# Altium project DDR4-UDIMM — 16 GB DDR4.PrjPcb (part 2 of 2)
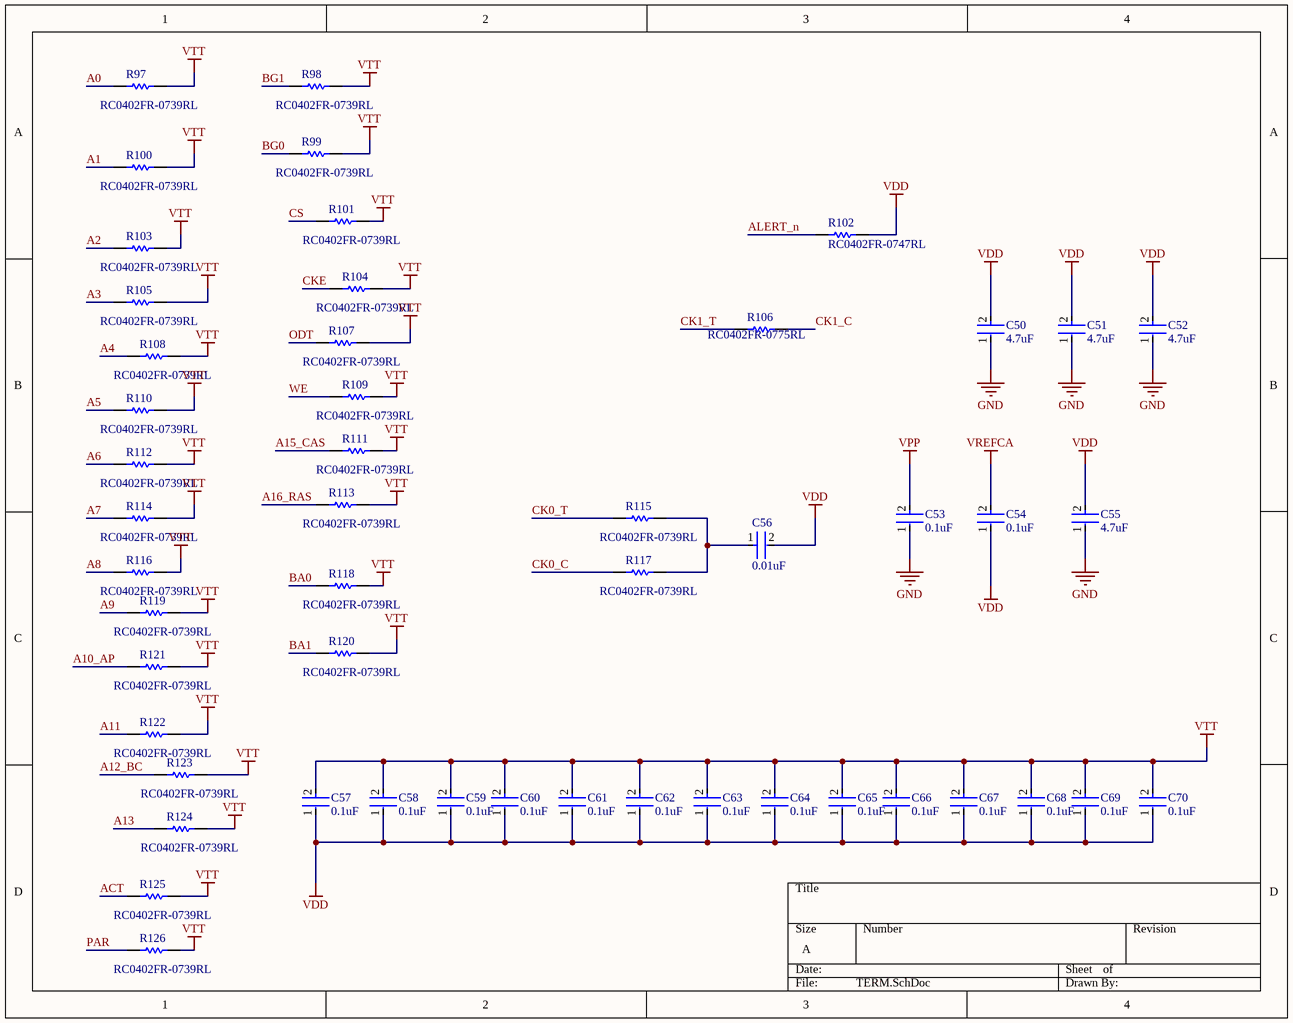
[diagram p11: TERM.SchDoc]

## Nets that join several sheets
GND: micron_ram (20 pins), micron_P2 (20 pins), micron_P3 (20 pins), micron_P4 (20 pins), micron_P5 (20 pins), micron_P6 (20 pins), micron_P7 (20 pins), micron_P8 (20 pins), edge (94 pins), SPD (C49.1 U9.4), TERM (5 pins)
VDD: micron_ram (18 pins), micron_P2 (18 pins), micron_P3 (18 pins), micron_P4 (18 pins), micron_P5 (18 pins), micron_P6 (18 pins), micron_P7 (18 pins), micron_P8 (18 pins), edge (26 pins), TERM (21 pins)
VDDSPD: edge (J1.284), SPD (C49.2 U9.8)
VPP: micron_ram (C5.2 C6.2 U1.B1 U1.M9), micron_P2 (C11.2 C12.2 U2.B1 U2.M9), micron_P3 (C17.2 C18.2 U3.B1 U3.M9), micron_P4 (C23.2 C24.2 U4.B1 U4.M9), micron_P5 (C29.2 C30.2 U5.B1 U5.M9), micron_P6 (C35.2 C36.2 U6.B1 U6.M9), micron_P7 (C41.2 C42.2 U7.B1 U7.M9), micron_P8 (C47.2 C48.2 U8.B1 U8.M9), edge (5 pins), TERM (C53.2)
VREFCA: micron_ram (C1.1 U1.J1), micron_P2 (C7.1 U2.J1), micron_P3 (C13.1 U3.J1), micron_P4 (C19.1 U4.J1), micron_P5 (C25.1 U5.J1), micron_P6 (C31.1 U6.J1), micron_P7 (C37.1 U7.J1), micron_P8 (C43.1 U8.J1), edge (J1.146), TERM (C54.2)
VTT: edge (J1.77 J1.221), TERM (40 pins)
A0: micron_ram (U1.L3), micron_P2 (U2.L3), micron_P3 (U3.L3), micron_P4 (U4.L3), micron_P5 (U5.L3), micron_P6 (U6.L3), micron_P7 (U7.L3), micron_P8 (U8.L3), edge (J1.79), TERM (R97.1)
A1: micron_ram (U1.L7), micron_P2 (U2.L7), micron_P3 (U3.L7), micron_P4 (U4.L7), micron_P5 (U5.L7), micron_P6 (U6.L7), micron_P7 (U7.L7), micron_P8 (U8.L7), edge (J1.72), TERM (R100.1)
A2: micron_ram (U1.M3), micron_P2 (U2.M3), micron_P3 (U3.M3), micron_P4 (U4.M3), micron_P5 (U5.M3), micron_P6 (U6.M3), micron_P7 (U7.M3), micron_P8 (U8.M3), edge (J1.216), TERM (R103.1)
A3: micron_ram (U1.K7), micron_P2 (U2.K7), micron_P3 (U3.K7), micron_P4 (U4.K7), micron_P5 (U5.K7), micron_P6 (U6.K7), micron_P7 (U7.K7), micron_P8 (U8.K7), edge (J1.71), TERM (R105.1)
A4: micron_ram (U1.K3), micron_P2 (U2.K3), micron_P3 (U3.K3), micron_P4 (U4.K3), micron_P5 (U5.K3), micron_P6 (U6.K3), micron_P7 (U7.K3), micron_P8 (U8.K3), edge (J1.214), TERM (R108.1)
A5: micron_ram (U1.L8), micron_P2 (U2.L8), micron_P3 (U3.L8), micron_P4 (U4.L8), micron_P5 (U5.L8), micron_P6 (U6.L8), micron_P7 (U7.L8), micron_P8 (U8.L8), edge (J1.213), TERM (R110.1)
A6: micron_ram (U1.L2), micron_P2 (U2.L2), micron_P3 (U3.L2), micron_P4 (U4.L2), micron_P5 (U5.L2), micron_P6 (U6.L2), micron_P7 (U7.L2), micron_P8 (U8.L2), edge (J1.69), TERM (R112.1)
A7: micron_ram (U1.M8), micron_P2 (U2.M8), micron_P3 (U3.M8), micron_P4 (U4.M8), micron_P5 (U5.M8), micron_P6 (U6.M8), micron_P7 (U7.M8), micron_P8 (U8.M8), edge (J1.211), TERM (R114.1)
A8: micron_ram (U1.M2), micron_P2 (U2.M2), micron_P3 (U3.M2), micron_P4 (U4.M2), micron_P5 (U5.M2), micron_P6 (U6.M2), micron_P7 (U7.M2), micron_P8 (U8.M2), edge (J1.68), TERM (R116.1)
A9: micron_ram (U1.M7), micron_P2 (U2.M7), micron_P3 (U3.M7), micron_P4 (U4.M7), micron_P5 (U5.M7), micron_P6 (U6.M7), micron_P7 (U7.M7), micron_P8 (U8.M7), edge (J1.66), TERM (R119.1)
A10_AP: micron_ram (U1.J3), micron_P2 (U2.J3), micron_P3 (U3.J3), micron_P4 (U4.J3), micron_P5 (U5.J3), micron_P6 (U6.J3), micron_P7 (U7.J3), micron_P8 (U8.J3), edge (J1.225), TERM (R121.1)
A11: micron_ram (U1.N2), micron_P2 (U2.N2), micron_P3 (U3.N2), micron_P4 (U4.N2), micron_P5 (U5.N2), micron_P6 (U6.N2), micron_P7 (U7.N2), micron_P8 (U8.N2), edge (J1.210), TERM (R122.1)
A12_BC: micron_ram (U1.J7), micron_P2 (U2.J7), micron_P3 (U3.J7), micron_P4 (U4.J7), micron_P5 (U5.J7), micron_P6 (U6.J7), micron_P7 (U7.J7), micron_P8 (U8.J7), edge (J1.65), TERM (R123.1)
A13: micron_ram (U1.N8), micron_P2 (U2.N8), micron_P3 (U3.N8), micron_P4 (U4.N8), micron_P5 (U5.N8), micron_P6 (U6.N8), micron_P7 (U7.N8), micron_P8 (U8.N8), edge (J1.232), TERM (R124.1)
A15_CAS: micron_ram (U1.H7), micron_P2 (U2.H7), micron_P3 (U3.H7), micron_P4 (U4.H7), micron_P5 (U5.H7), micron_P6 (U6.H7), micron_P7 (U7.H7), micron_P8 (U8.H7), edge (J1.86), TERM (R111.1)
A16_RAS: micron_ram (U1.H8), micron_P2 (U2.H8), micron_P3 (U3.H8), micron_P4 (U4.H8), micron_P5 (U5.H8), micron_P6 (U6.H8), micron_P7 (U7.H8), micron_P8 (U8.H8), edge (J1.82), TERM (R113.1)
ACT: micron_ram (U1.H3), micron_P2 (U2.H3), micron_P3 (U3.H3), micron_P4 (U4.H3), micron_P5 (U5.H3), micron_P6 (U6.H3), micron_P7 (U7.H3), micron_P8 (U8.H3), edge (J1.62), TERM (R125.1)
ALERT_n: micron_ram (U1.L9), micron_P2 (U2.L9), micron_P3 (U3.L9), micron_P4 (U4.L9), micron_P5 (U5.L9), micron_P6 (U6.L9), micron_P7 (U7.L9), micron_P8 (U8.L9), edge (J1.208), TERM (R102.1)
BA0: micron_ram (U1.K2), micron_P2 (U2.K2), micron_P3 (U3.K2), micron_P4 (U4.K2), micron_P5 (U5.K2), micron_P6 (U6.K2), micron_P7 (U7.K2), micron_P8 (U8.K2), edge (J1.81), TERM (R118.1)
BA1: micron_ram (U1.K8), micron_P2 (U2.K8), micron_P3 (U3.K8), micron_P4 (U4.K8), micron_P5 (U5.K8), micron_P6 (U6.K8), micron_P7 (U7.K8), micron_P8 (U8.K8), edge (J1.224), TERM (R120.1)
BG0: micron_ram (U1.J2), micron_P2 (U2.J2), micron_P3 (U3.J2), micron_P4 (U4.J2), micron_P5 (U5.J2), micron_P6 (U6.J2), micron_P7 (U7.J2), micron_P8 (U8.J2), edge (J1.63), TERM (R99.1)
BG1: micron_ram (U1.J8), micron_P2 (U2.J8), micron_P3 (U3.J8), micron_P4 (U4.J8), micron_P5 (U5.J8), micron_P6 (U6.J8), micron_P7 (U7.J8), micron_P8 (U8.J8), edge (J1.207), TERM (R98.1)
CK0_C: micron_ram (U1.F8), micron_P2 (U2.F8), micron_P3 (U3.F8), micron_P4 (U4.F8), micron_P5 (U5.F8), micron_P6 (U6.F8), micron_P7 (U7.F8), micron_P8 (U8.F8), edge (J1.75), TERM (R117.1)
CK0_T: micron_ram (U1.F7), micron_P2 (U2.F7), micron_P3 (U3.F7), micron_P4 (U4.F7), micron_P5 (U5.F7), micron_P6 (U6.F7), micron_P7 (U7.F7), micron_P8 (U8.F7), edge (J1.74), TERM (R115.1)
CK1_C: edge (J1.219), TERM (R106.2)
CK1_T: edge (J1.218), TERM (R106.1)
CKE: micron_ram (U1.G3), micron_P2 (U2.G3), micron_P3 (U3.G3), micron_P4 (U4.G3), micron_P5 (U5.G3), micron_P6 (U6.G3), micron_P7 (U7.G3), micron_P8 (U8.G3), edge (J1.60), TERM (R104.1)
CS: micron_ram (U1.G7), micron_P2 (U2.G7), micron_P3 (U3.G7), micron_P4 (U4.G7), micron_P5 (U5.G7), micron_P6 (U6.G7), micron_P7 (U7.G7), micron_P8 (U8.G7), edge (J1.84), TERM (R101.1)
DM0: micron_ram (R11.2), edge (J1.7)
DM1: micron_P2 (R23.2), edge (J1.18)
DM2: micron_P3 (R35.2), edge (J1.29)
DM3: micron_P4 (R47.2), edge (J1.40)
DM4: micron_P5 (R59.2), edge (J1.99)
DM5: micron_P6 (R71.2), edge (J1.110)
DM6: micron_P7 (R83.2), edge (J1.121)
DM7: micron_P8 (R95.2), edge (J1.132)
DQ0: micron_ram (R2.2), edge (J1.5)
DQ1: micron_ram (R3.2), edge (J1.150)
DQ2: micron_ram (R4.2), edge (J1.12)
DQ3: micron_ram (R5.2), edge (J1.157)
DQ4: micron_ram (R6.2), edge (J1.3)
DQ5: micron_ram (R12.2), edge (J1.148)
DQ6: micron_ram (R7.2), edge (J1.10)
DQ7: micron_ram (R8.2), edge (J1.155)
DQ8: micron_P2 (R14.2), edge (J1.16)
DQ9: micron_P2 (R15.2), edge (J1.161)
DQ10: micron_P2 (R16.2), edge (J1.23)
DQ11: micron_P2 (R17.2), edge (J1.168)
DQ12: micron_P2 (R18.2), edge (J1.14)
DQ13: micron_P2 (R24.2), edge (J1.159)
DQ14: micron_P2 (R19.2), edge (J1.21)
DQ15: micron_P2 (R20.2), edge (J1.166)
DQ16: micron_P3 (R26.2), edge (J1.27)
DQ17: micron_P3 (R27.2), edge (J1.172)
DQ18: micron_P3 (R28.2), edge (J1.34)
DQ19: micron_P3 (R29.2), edge (J1.179)
DQ20: micron_P3 (R30.2), edge (J1.25)
DQ21: micron_P3 (R36.2), edge (J1.170)
DQ22: micron_P3 (R31.2), edge (J1.32)
DQ23: micron_P3 (R32.2), edge (J1.177)
DQ24: micron_P4 (R38.2), edge (J1.38)
DQ25: micron_P4 (R39.2), edge (J1.183)
DQ26: micron_P4 (R40.2), edge (J1.45)
DQ27: micron_P4 (R41.2), edge (J1.190)
DQ28: micron_P4 (R42.2), edge (J1.36)
DQ29: micron_P4 (R48.2), edge (J1.181)
DQ30: micron_P4 (R43.2), edge (J1.43)
DQ31: micron_P4 (R44.2), edge (J1.188)
DQ32: micron_P5 (R50.2), edge (J1.97)
DQ33: micron_P5 (R51.2), edge (J1.242)
DQ34: micron_P5 (R52.2), edge (J1.104)
DQ35: micron_P5 (R53.2), edge (J1.249)
DQ36: micron_P5 (R54.2), edge (J1.95)
DQ37: micron_P5 (R60.2), edge (J1.240)
DQ38: micron_P5 (R55.2), edge (J1.102)
DQ39: micron_P5 (R56.2), edge (J1.247)
DQ40: micron_P6 (R62.2), edge (J1.108)
DQ41: micron_P6 (R63.2), edge (J1.253)
DQ42: micron_P6 (R64.2), edge (J1.115)
DQ43: micron_P6 (R65.2), edge (J1.260)
DQ44: micron_P6 (R66.2), edge (J1.106)
DQ45: micron_P6 (R72.2), edge (J1.251)
DQ46: micron_P6 (R67.2), edge (J1.113)
DQ47: micron_P6 (R68.2), edge (J1.258)
DQ48: micron_P7 (R74.2), edge (J1.119)
DQ49: micron_P7 (R75.2), edge (J1.264)
DQ50: micron_P7 (R76.2), edge (J1.126)
DQ51: micron_P7 (R77.2), edge (J1.271)
DQ52: micron_P7 (R78.2), edge (J1.117)
DQ53: micron_P7 (R84.2), edge (J1.262)
DQ54: micron_P7 (R79.2), edge (J1.124)
DQ55: micron_P7 (R80.2), edge (J1.269)
DQ56: micron_P8 (R86.2), edge (J1.130)
DQ57: micron_P8 (R87.2), edge (J1.275)
DQ58: micron_P8 (R88.2), edge (J1.137)
DQ59: micron_P8 (R89.2), edge (J1.282)
DQ60: micron_P8 (R90.2), edge (J1.128)
DQ61: micron_P8 (R96.2), edge (J1.273)
DQ62: micron_P8 (R91.2), edge (J1.135)
DQ63: micron_P8 (R92.2), edge (J1.280)
DQS0_C: micron_ram (R10.2), edge (J1.152)
DQS0_T: micron_ram (R9.2), edge (J1.153)
DQS1_C: micron_P2 (R22.2), edge (J1.163)
DQS1_T: micron_P2 (R21.2), edge (J1.164)
DQS2_C: micron_P3 (R34.2), edge (J1.174)
DQS2_T: micron_P3 (R33.2), edge (J1.175)
DQS3_C: micron_P4 (R46.2), edge (J1.185)
DQS3_T: micron_P4 (R45.2), edge (J1.186)
DQS4_C: micron_P5 (R58.2), edge (J1.244)
DQS4_T: micron_P5 (R57.2), edge (J1.245)
DQS5_C: micron_P6 (R70.2), edge (J1.255)
DQS5_T: micron_P6 (R69.2), edge (J1.256)
DQS6_C: micron_P7 (R82.2), edge (J1.266)
DQS6_T: micron_P7 (R81.2), edge (J1.267)
DQS7_C: micron_P8 (R94.2), edge (J1.277)
DQS7_T: micron_P8 (R93.2), edge (J1.278)
ODT: micron_ram (U1.F3), micron_P2 (U2.F3), micron_P3 (U3.F3), micron_P4 (U4.F3), micron_P5 (U5.F3), micron_P6 (U6.F3), micron_P7 (U7.F3), micron_P8 (U8.F3), edge (J1.87), TERM (R107.1)
PAR: micron_ram (U1.N3), micron_P2 (U2.N3), micron_P3 (U3.N3), micron_P4 (U4.N3), micron_P5 (U5.N3), micron_P6 (U6.N3), micron_P7 (U7.N3), micron_P8 (U8.N3), edge (J1.222), TERM (R126.1)
RESET_N: micron_ram (U1.L1), micron_P2 (U2.L1), micron_P3 (U3.L1), micron_P4 (U4.L1), micron_P5 (U5.L1), micron_P6 (U6.L1), micron_P7 (U7.L1), micron_P8 (U8.L1), edge (J1.58)
SA0: edge (J1.139), SPD (U9.1)
SA1: edge (J1.140), SPD (U9.2)
SA2: edge (J1.238), SPD (U9.3)
SCL: edge (J1.141), SPD (U9.6)
SDA: edge (J1.285), SPD (U9.5)
WE: micron_ram (U1.H2), micron_P2 (U2.H2), micron_P3 (U3.H2), micron_P4 (U4.H2), micron_P5 (U5.H2), micron_P6 (U6.H2), micron_P7 (U7.H2), micron_P8 (U8.H2), edge (J1.228), TERM (R109.1)